# EAGLE design opto-endstop 1.2 (EAGLE 6.1)
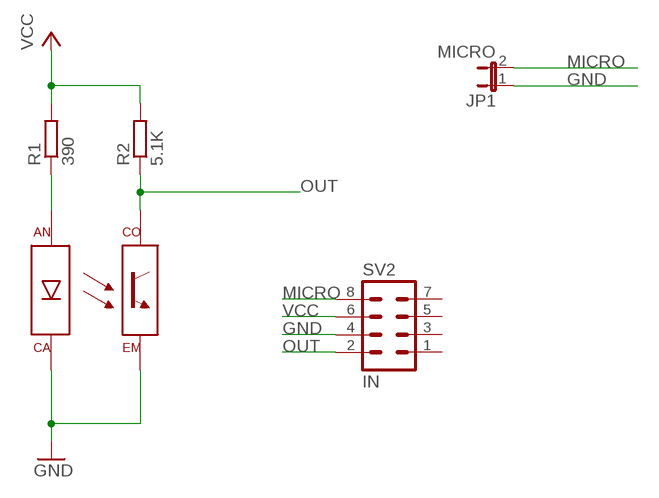
[diagram p0: schematic, sheet 1]

## Parts
JP1  MICRO  JP1E  [JP1]
R1  390  R-EU_0204/5  [0204/5]
R2  5.1K  R-EU_0204/5  [0204/5]
SV2  IN  MA04-2  [MA04-2]
U$1  KTIR0521DS  [KTIR0521DS]

## Nets
GND: JP1.1 SV2.4 U$1.CA U$1.EM
MICRO: JP1.2 SV2.8
N$2: R1.1 U$1.AN
OUT: R2.1 SV2.2 U$1.CO
VCC: R1.2 R2.2 SV2.6
Unconnected: SV2.1 SV2.3 SV2.5 SV2.7

## Library data of the parts
JP1 = jumper:JP1E: JUMPER
R1 R2 = rcl:R-EU_: RESISTOR, European symbol
SV2 = con-lstb:MA04-2: PIN HEADER; OC_FARNELL: unknown; OC_NEWARK: unknown
U$1 = local-lib:KTIR0521DS

## Board
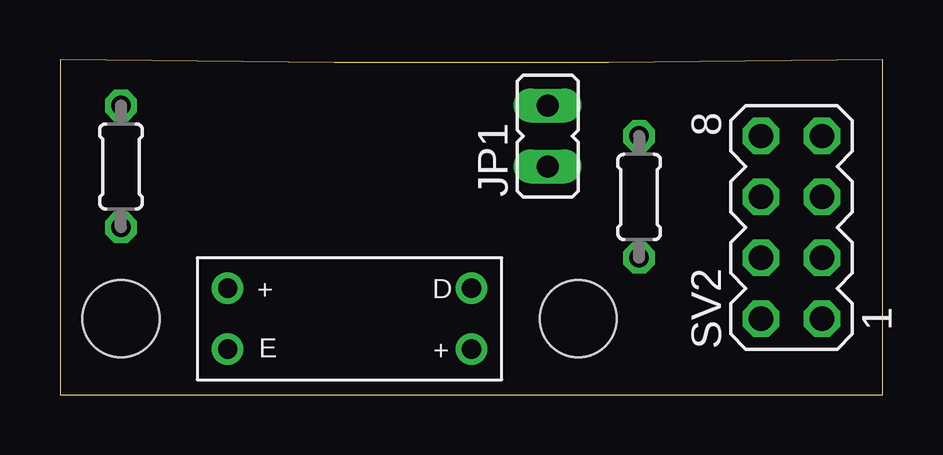
[diagram p1: board, top side]
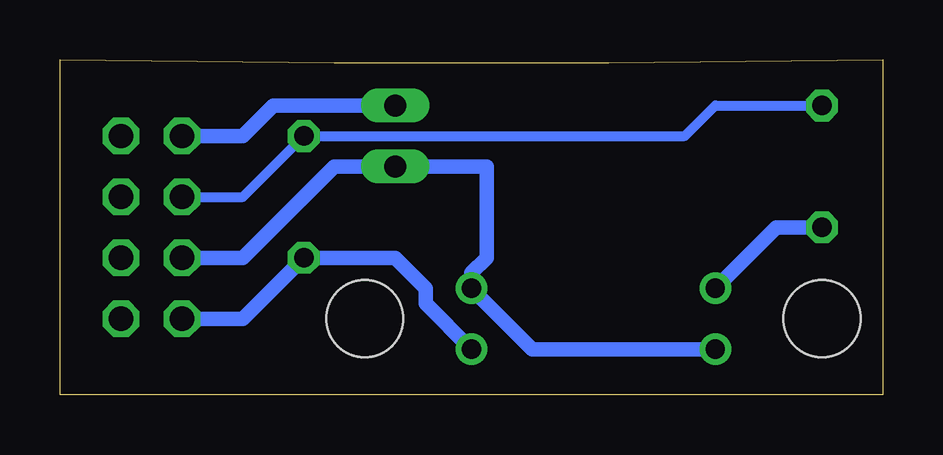
[diagram p2: board, bottom side, seen from below]

Size 34.29 x 13.97 mm. Coordinates in mm from the lower left corner, seen from the top.
Outline: 0,0 34.29,0 34.29,13.97 arc-2 0,13.97 0,0
Copper layers (1*16): Top 0.018mm / dielectric 1.5mm / Bottom 0.018mm
Design rules: minimum track width 0.15mm, minimum drill 0.6mm, track to track 0.15mm, track to pad 0.15mm, pad to pad 0.15mm, via to via 0.15mm, smd to smd 0.15mm, copper to edge 0.3mm, drill to drill 8mil, minimum pad ring 10mil, minimum via ring 8mil, stop-mask expansion 0.1mm, vias tented up to drill 0mil, thermal gap 10mil
Holes 3.2 mm at 2.54,3.17 21.59,3.17

### Footprints (pad centres in the part's own frame; a part is rotated, then mirrored left to right if it is on the bottom)
JP1 = drill 0.914 long: 1 0,-1.27; 2 0,1.27
0204/5 = drill 0.813 octagon: 1 -2.54,0; 2 2.54,0
MA04-2 = drill 1.016 octagon: 1 -3.81,-1.27; 2 -3.81,1.27; 3 -1.27,-1.27; 4 -1.27,1.27; 5 1.27,-1.27; 6 1.27,1.27; 7 3.81,-1.27; 8 3.81,1.27
KTIR0521DS = drill 0.8: AN 1.27,3.81; CA 1.27,1.27; CO 11.43,1.27; EM 11.43,3.81

### Placement (x,y rotation side)
JP1  20.32,10.79 0 top
R1  2.54,9.53 90 top
R2  24.13,8.26 90 top
SV2  30.48,6.99 90 top
U$1  5.71,0.64 0 top

### Tracks (layer width: path | path; a pad name or v marks a point on that pad's centre or on a via)
GND
  Bottom 0.406: 17.14,5.08 U$1.EM
  Bottom 0.61: U$1.CA 14.61,1.91 U$1.EM | SV2.4 26.67,5.71 22.86,9.53 JP1.1 16.51,9.53 16.51,5.71 17.14,5.08
MICRO
  Bottom 0.61: SV2.8 26.67,10.79 25.4,12.06 JP1.2
N$2
  Bottom 0.61: R1.1 4.45,6.99 U$1.AN
OUT
  Bottom 0.61: SV2.2 26.67,3.17 R2.1 20.32,5.71 19.05,4.45 19.05,3.81 U$1.CO
VCC
  Bottom 0.406: SV2.6 26.67,8.26 R2.2 8.26,10.79 6.99,12.06 R1.2